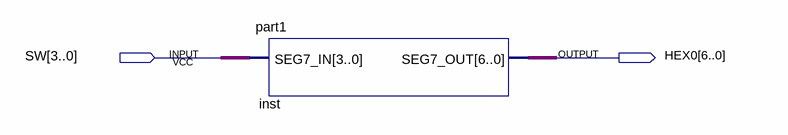
[diagram p0: schematic sheet]
// Quartus schematic part1_sch.bdf as structural Verilog: 1 symbols, 2 pins
module part1_sch (
  input  [3:0] SW,
  output [6:0] HEX0
);

  part1 inst (.SEG7_IN(SW), .SEG7_OUT(HEX0));
endmodule
